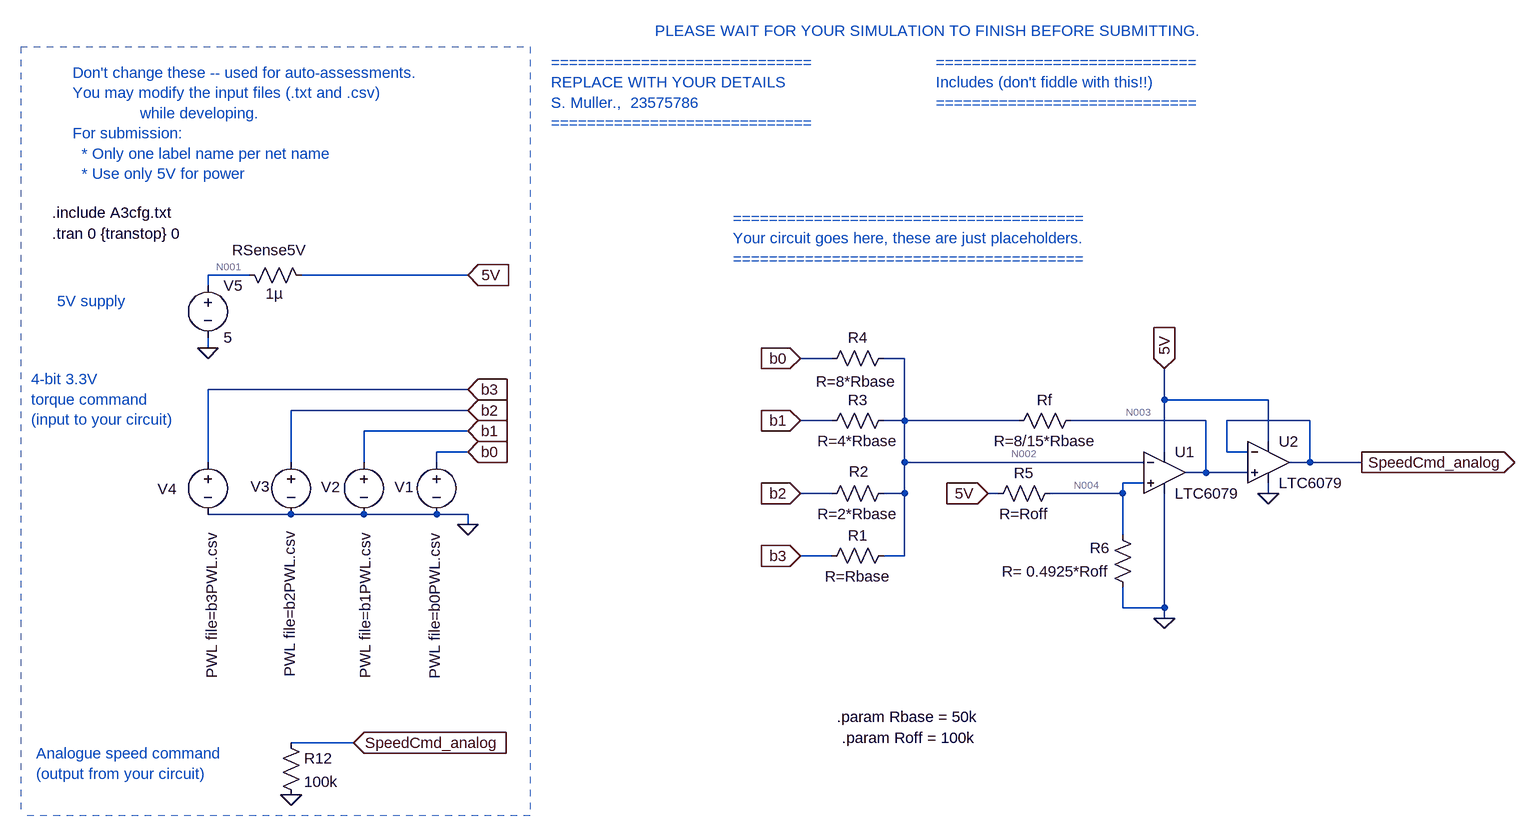
[diagram p0: schematic E344_23575786_Ass3.asc]
E344_23575786_Ass3.asc, the LTspice schematic file:
Version 4
SHEET 1 1824 2192
WIRE -2016 -1072 -2080 -1072
WIRE -1680 -1072 -1936 -1072
WIRE -2080 -1056 -2080 -1072
WIRE -2080 -960 -2080 -976
WIRE -1120 -944 -1168 -944
WIRE -1008 -944 -1040 -944
WIRE -1680 -896 -2080 -896
WIRE -608 -880 -608 -928
WIRE -448 -880 -608 -880
WIRE -1680 -864 -1952 -864
WIRE -1120 -848 -1168 -848
WIRE -1008 -848 -1008 -944
WIRE -1008 -848 -1040 -848
WIRE -832 -848 -1008 -848
WIRE -544 -848 -752 -848
WIRE -384 -848 -512 -848
WIRE -1680 -832 -1840 -832
WIRE -448 -816 -448 -880
WIRE -1680 -800 -1728 -800
WIRE -608 -800 -608 -880
WIRE -512 -800 -512 -848
WIRE -480 -800 -512 -800
WIRE -2080 -784 -2080 -896
WIRE -1952 -784 -1952 -864
WIRE -1840 -784 -1840 -832
WIRE -1728 -784 -1728 -800
WIRE -1008 -784 -1008 -848
WIRE -640 -784 -1008 -784
WIRE -384 -784 -384 -848
WIRE -384 -784 -416 -784
WIRE -304 -784 -384 -784
WIRE -544 -768 -544 -848
WIRE -544 -768 -576 -768
WIRE -480 -768 -544 -768
WIRE -640 -752 -672 -752
WIRE -1120 -736 -1168 -736
WIRE -1008 -736 -1008 -784
WIRE -1008 -736 -1040 -736
WIRE -864 -736 -880 -736
WIRE -672 -736 -672 -752
WIRE -672 -736 -784 -736
WIRE -448 -736 -448 -752
WIRE -1952 -704 -2080 -704
WIRE -1840 -704 -1952 -704
WIRE -1728 -704 -1840 -704
WIRE -1680 -704 -1728 -704
WIRE -1680 -688 -1680 -704
WIRE -672 -672 -672 -736
WIRE -1120 -640 -1168 -640
WIRE -1008 -640 -1008 -736
WIRE -1008 -640 -1040 -640
WIRE -672 -560 -672 -592
WIRE -608 -560 -608 -736
WIRE -608 -560 -672 -560
WIRE -608 -544 -608 -560
WIRE -1856 -352 -1952 -352
FLAG -1680 -1072 5V
IOPIN -1680 -1072 In
FLAG -2080 -960 0
FLAG -608 -928 5V
IOPIN -608 -928 In
FLAG -304 -784 SpeedCmd_analog
IOPIN -304 -784 Out
FLAG -1680 -688 0
FLAG -1680 -896 b3
IOPIN -1680 -896 In
FLAG -1680 -864 b2
IOPIN -1680 -864 In
FLAG -1680 -832 b1
IOPIN -1680 -832 In
FLAG -1680 -800 b0
IOPIN -1680 -800 In
FLAG -1168 -640 b3
IOPIN -1168 -640 In
FLAG -1168 -736 b2
IOPIN -1168 -736 In
FLAG -1168 -848 b1
IOPIN -1168 -848 In
FLAG -1168 -944 b0
IOPIN -1168 -944 In
FLAG -1856 -352 SpeedCmd_analog
IOPIN -1856 -352 In
FLAG -1952 -272 0
FLAG -608 -544 0
FLAG -880 -736 5V
IOPIN -880 -736 In
FLAG -448 -736 0
SYMBOL voltage -2080 -1072 R0
WINDOW 123 0 0 Left 0
WINDOW 39 0 0 Left 0
SYMATTR InstName V5
SYMATTR Value 5
SYMBOL res -2032 -1088 M90
WINDOW 0 -7 47 VBottom 2
WINDOW 3 29 54 VTop 2
SYMATTR InstName RSense5V
SYMATTR Value 1µ
SYMBOL voltage -1728 -800 R0
WINDOW 3 -3 125 VRight 2
WINDOW 123 0 0 Left 0
WINDOW 39 0 0 Left 0
WINDOW 0 -65 54 Left 2
SYMATTR Value PWL file=b0PWL.csv
SYMATTR InstName V1
SYMBOL voltage -1840 -800 R0
WINDOW 3 2 124 VRight 2
WINDOW 123 0 0 Left 0
WINDOW 39 0 0 Left 0
WINDOW 0 -66 54 Left 2
SYMATTR Value PWL file=b1PWL.csv
SYMATTR InstName V2
SYMBOL voltage -1952 -800 R0
WINDOW 3 -2 122 VRight 2
WINDOW 123 0 0 Left 0
WINDOW 39 0 0 Left 0
WINDOW 0 -62 53 Left 2
SYMATTR Value PWL file=b2PWL.csv
SYMATTR InstName V3
SYMBOL voltage -2080 -800 R0
WINDOW 3 6 124 VRight 2
WINDOW 123 0 0 Left 0
WINDOW 39 0 0 Left 0
WINDOW 0 -77 57 Left 2
SYMATTR Value PWL file=b3PWL.csv
SYMATTR InstName V4
SYMBOL res -1968 -368 R0
SYMATTR InstName R12
SYMATTR Value 100k
SYMBOL Opamps\\LTC6079 -608 -768 R0
SYMATTR InstName U1
SYMBOL res -1024 -656 R90
WINDOW 0 0 56 VBottom 2
WINDOW 3 32 56 VTop 2
SYMATTR InstName R1
SYMATTR Value R=Rbase
SYMBOL res -1024 -752 R90
WINDOW 0 -2 54 VBottom 2
WINDOW 3 32 56 VTop 2
SYMATTR InstName R2
SYMATTR Value R=2*Rbase
SYMBOL res -1024 -864 R90
WINDOW 0 0 56 VBottom 2
WINDOW 3 32 56 VTop 2
SYMATTR InstName R3
SYMATTR Value R=4*Rbase
SYMBOL res -1024 -960 R90
WINDOW 0 0 56 VBottom 2
WINDOW 3 36 58 VTop 2
SYMATTR InstName R4
SYMATTR Value R=8*Rbase
SYMBOL res -736 -864 R90
WINDOW 0 0 56 VBottom 2
WINDOW 3 32 56 VTop 2
SYMATTR InstName Rf
SYMATTR Value R=8/15*Rbase
SYMBOL res -656 -576 R180
WINDOW 0 36 76 Left 2
WINDOW 3 36 40 Left 2
SYMATTR InstName R6
SYMATTR Value R= 0.4925*Roff
SYMBOL res -880 -720 R270
WINDOW 0 32 56 VTop 2
WINDOW 3 0 56 VBottom 2
SYMATTR InstName R5
SYMATTR Value R=Roff
SYMBOL Opamps\\LTC6079 -448 -784 R0
SYMATTR InstName U2
TEXT -2288 -1384 Left 2 ;Don't change these -- used for auto-assessments.\nYou may modify the input files (.txt and .csv) \n               while developing.\nFor submission: \n  * Only one label name per net name\n  * Use only 5V for power
TEXT -1552 -1400 Left 2 ;=============================\nREPLACE WITH YOUR DETAILS\nS. Muller.,  23575786\n=============================
TEXT -960 -1400 Left 2 ;=============================\nIncludes (don't fiddle with this!!)\n=============================
TEXT -1272 -1160 Left 2 ;=======================================\nYour circuit goes here, these are just placeholders.\n=======================================
TEXT -1392 -1448 Left 2 ;PLEASE WAIT FOR YOUR SIMULATION TO FINISH BEFORE SUBMITTING.
TEXT -2320 -1136 Left 2 !.tran 0 {transtop} 0
TEXT -2320 -1168 Left 2 !.include A3cfg.txt
TEXT -2312 -1032 Left 2 ;5V supply
TEXT -2352 -912 Left 2 ;4-bit 3.3V\ntorque command\n(input to your circuit)
TEXT -2344 -336 Left 2 ;Analogue speed command\n(output from your circuit)
TEXT -1112 -392 Left 2 !.param Rbase = 50k
TEXT -1104 -360 Left 2 !.param Roff = 100k
LINE Normal -1584 -1424 -1584 -240 2
LINE Normal -2368 -1424 -1584 -1424 2
LINE Normal -1584 -240 -2368 -240 2
LINE Normal -1584 -256 -1584 -256 2
LINE Normal -2368 -1424 -2368 -240 2

The netlist it stands for:
* E344_23575786_Ass3.asc
V5 N001 0 5
RSense5V N001 5V 1µ
V1 b0 0 PWL file=b0PWL.csv
V2 b1 0 PWL file=b1PWL.csv
V3 b2 0 PWL file=b2PWL.csv
V4 b3 0 PWL file=b3PWL.csv
R12 SpeedCmd_analog 0 100k
XU1 N004 N002 5V 0 N003 LTC6078  ; LTC6079, pins In+ In- V+ V- OUT
R1 N002 b3 R=Rbase
R2 N002 b2 R=2*Rbase
R3 N002 b1 R=4*Rbase
R4 N002 b0 R=8*Rbase
Rf N003 N002 R=8/15*Rbase
R6 0 N004 R= 0.4925*Roff
R5 5V N004 R=Roff
XU2 N003 SpeedCmd_analog 5V 0 SpeedCmd_analog LTC6078  ; LTC6079, pins In+ In- V+ V- OUT
* Don't change these -- used for auto-assessments.
* You may modify the input files (.txt and .csv)
*                while developing.
* For submission:
*   * Only one label name per net name
*   * Use only 5V for power
* =============================
* REPLACE WITH YOUR DETAILS
* S. Muller.,  23575786
* =============================
* =============================
* Includes (don't fiddle with this!!)
* =============================
* =======================================
* Your circuit goes here, these are just placeholders.
* =======================================
* PLEASE WAIT FOR YOUR SIMULATION TO FINISH BEFORE SUBMITTING.
.tran 0 {transtop} 0
.include A3cfg.txt
* 5V supply
* 4-bit 3.3V
* torque command
* (input to your circuit)
* Analogue speed command
* (output from your circuit)
.param Rbase = 50k
.param Roff = 100k
.lib LTC5.lib
.backanno
.end

* Results of the author's LTspice run, read from the files saved beside the schematic
* Operating Point, zero values left out:
*   V(n001) = 5 V
*   V(5v) = 5 V
*   V(speedcmd_analog) = 3.3 V
*   V(n004) = 1.65 V
*   V(n002) = 1.65 V
*   V(n003) = 3.3 V
*   I(R5) = 33.5 µA
*   I(R6) = -33.5 µA
*   I(Rf) = 61.87 µA
*   I(R4) = 4.125 µA
*   I(R3) = 8.25 µA
*   I(R2) = 16.5 µA
*   I(R1) = 33 µA
*   I(R12) = 33 µA
*   I(Rsense5v) = 210.9 µA
*   I(V4) = 33 µA
*   I(V3) = 16.5 µA
*   I(V2) = 8.25 µA
*   I(V1) = 4.125 µA
*   I(V5) = -210.9 µA
*   Ix(u1:3) = 101.2 µA
*   Ix(u1:4) = -39.3 µA
*   Ix(u1:5) = -61.87 µA
*   Ix(u2:3) = 76.25 µA
*   Ix(u2:4) = -43.25 µA
*   Ix(u2:5) = -33 µA
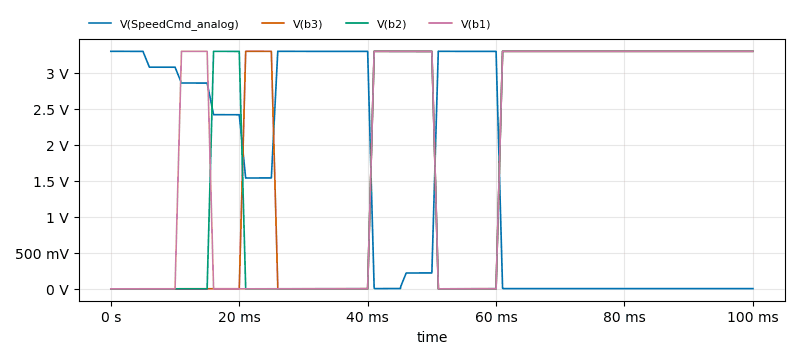
[diagram p1: Transient Analysis of E344_23575786_Ass3.asc, plotted from the saved traces]
* Transient Analysis, 1 run:
*   V(SpeedCmd_analog): min 3.296 mV, max 3.301 V, average 1.514 V, rms 2.136 V, last 3.304 mV
*   V(b3): min 0 V, max 3.3 V, average 1.798 V, rms 2.419 V, last 3.3 V
*   V(b2): min 0 V, max 3.3 V, average 1.798 V, rms 2.419 V, last 3.3 V
*   V(b1): min 0 V, max 3.3 V, average 1.798 V, rms 2.422 V, last 3.3 V